# Altium schematic sheet TDC.SchDoc: TDC
size 420 x 297 mm; CheckedBy: -; CompanyName: CERN; DrawnBy: GK; Organization: CERN; Address1: European Organization for Nuclear Research; Address2: CH-1211 Genève 23 - Switzerland; Revision: -; SheetNumber: 7; SheetTotal: 9; EDA_Number: EDA-XXXXX-VX-X; Projet: FMC Delay 1ns 4cha; ModifiedBy: -; CreateDate: XX/XX/XXXX; CheckedDate: -; Title2: Title2; DivGrp: BE-CO; Designer: GK; ModifiedDate: -
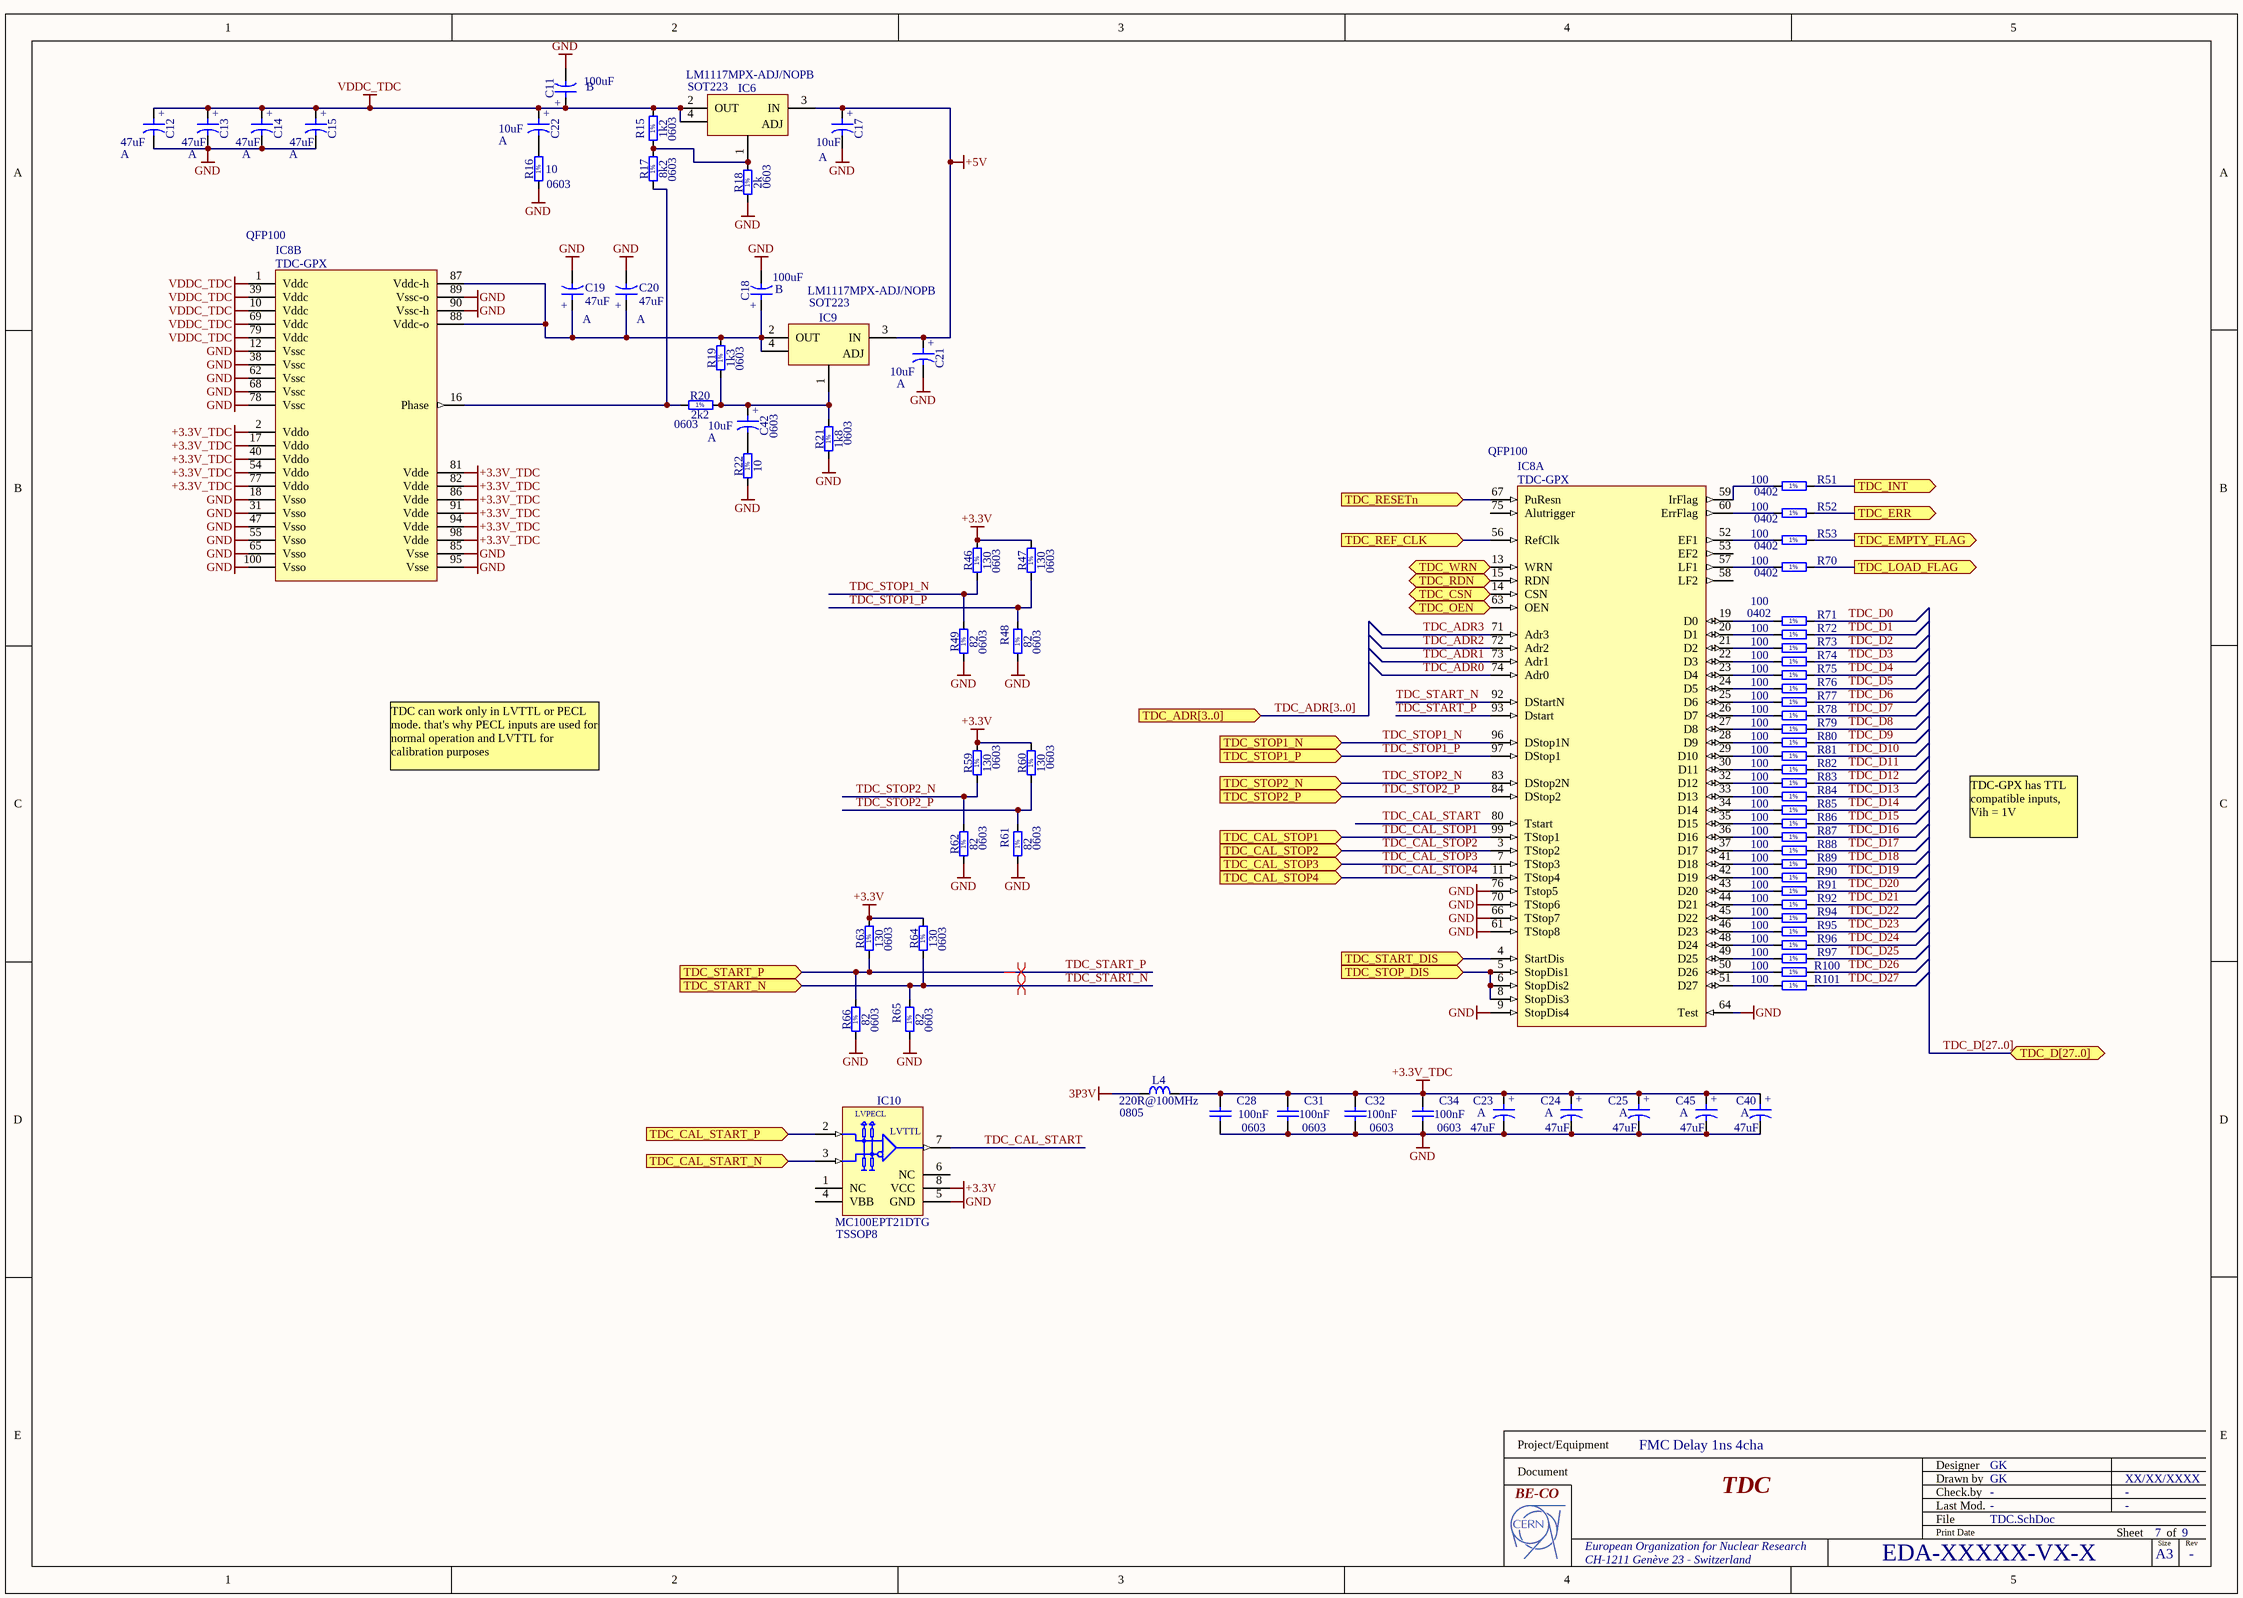
[diagram p0: TDC.SchDoc]

## Parts
C11  100uF  Case: B  [CAPMP3528X210N]
C12  47uF  Case: A  [CAPMP3216X180N]
C13  47uF  Case: A  [CAPMP3216X180N]
C14  47uF  Case: A  [CAPMP3216X180N]
C15  47uF  Case: A  [CAPMP3216X180N]
C17  10uF  Case: A  [CAPMP3216X180N]
C18  100uF  Case: B  [CAPMP3528X210N]
C19  47uF  Case: A  [CAPMP3216X180N]
C20  47uF  Case: A  [CAPMP3216X180N]
C21  10uF  Case: A  [CAPMP3216X180N]
C22  10uF  Case: A  [CAPMP3216X180N]
C23  47uF  Case: A  [CAPMP3216X180N]
C24  47uF  Case: A  [CAPMP3216X180N]
C25  47uF  Case: A  [CAPMP3216X180N]
C28  100nF  Case: 0603  [CAPC1608X87N]
C31  100nF  Case: 0603  [CAPC1608X87N]
C32  100nF  Case: 0603  [CAPC1608X87N]
C34  100nF  Case: 0603  [CAPC1608X87N]
C40  47uF  Case: A  [CAPMP3216X180N]
C42  10uF  Case: A  [CAPMP3216X180N]
C45  47uF  Case: A  [CAPMP3216X180N]
IC6  LM1117MPX-ADJ/NOPB  Case: SOT223  [SOT230P700X180-4N]
IC8  TDC-GPX  Case: QFP100  [QFP50P1600X1600X120-100N]  (parts A,B of 2)
IC9  LM1117MPX-ADJ/NOPB  Case: SOT223  [SOT230P700X180-4N]
IC10  MC100EPT21DTG  Case: TSSOP8  [SOP65P490X110-8N]
L4  220R@100MHz  Case: 0805  [INDC2012X105N]
R15  1k2  Case: 0603  [RESC1608X55N]
R16  10  Case: 0603  [RESC1608X55N]
R17  8k2  Case: 0603  [RESC1608X55N]
R18  2k  Case: 0603  [RESC1608X55N]
R19  1k3  Case: 0603  [RESC1608X55N]
R20  2k2  Case: 0603  [RESC1608X55N]
R21  1k8  Case: 0603  [RESC1608X55N]
R22  10  Case: 0603  [RESC1608X55N]
R46  130  Case: 0603  [RESC1608X55N]
R47  130  Case: 0603  [RESC1608X55N]
R48  82  Case: 0603  [RESC1608X55N]
R49  82  Case: 0603  [RESC1608X55N]
R51  100  Case: 0402  [RESC1005X40N]
R52  100  Case: 0402  [RESC1005X40N]
R53  100  Case: 0402  [RESC1005X40N]
R59  130  Case: 0603  [RESC1608X55N]
R60  130  Case: 0603  [RESC1608X55N]
R61  82  Case: 0603  [RESC1608X55N]
R62  82  Case: 0603  [RESC1608X55N]
R63  130  Case: 0603  [RESC1608X55N]
R64  130  Case: 0603  [RESC1608X55N]
R65  82  Case: 0603  [RESC1608X55N]
R66  82  Case: 0603  [RESC1608X55N]
R70  100  Case: 0402  [RESC1005X40N]
R71  100  Case: 0402  [RESC1005X40N]
R72  100  [RESC1005X40N]
R73  100  [RESC1005X40N]
R74  100  [RESC1005X40N]
R75  100  [RESC1005X40N]
R76  100  [RESC1005X40N]
R77  100  [RESC1005X40N]
R78  100  [RESC1005X40N]
R79  100  [RESC1005X40N]
R80  100  [RESC1005X40N]
R81  100  [RESC1005X40N]
R82  100  [RESC1005X40N]
R83  100  [RESC1005X40N]
R84  100  [RESC1005X40N]
R85  100  [RESC1005X40N]
R86  100  [RESC1005X40N]
R87  100  [RESC1005X40N]
R88  100  [RESC1005X40N]
R89  100  [RESC1005X40N]
R90  100  [RESC1005X40N]
R91  100  [RESC1005X40N]
R92  100  [RESC1005X40N]
R94  100  [RESC1005X40N]
R95  100  [RESC1005X40N]
R96  100  [RESC1005X40N]
R97  100  [RESC1005X40N]
R100  100  [RESC1005X40N]
R101  100  [RESC1005X40N]

## Ports
TDC_ADR[3..0] (in), TDC_CAL_START_N (in), TDC_CAL_START_P (in), TDC_CAL_STOP1 (in), TDC_CAL_STOP2 (in), TDC_CAL_STOP3 (in), TDC_CAL_STOP4 (in), TDC_CSN (in), TDC_D[27..0] (bidir), TDC_EMPTY_FLAG (out), TDC_ERR (out), TDC_INT (out), TDC_LOAD_FLAG (out), TDC_OEN (in), TDC_RDN (in), TDC_REF_CLK (in), TDC_RESETn (in), TDC_START_DIS (in), TDC_START_N (in), TDC_START_P (in), TDC_STOP1_N (in), TDC_STOP1_P (in), TDC_STOP2_N (in), TDC_STOP2_P (in), TDC_STOP_DIS (in), TDC_WRN (in)

## Nets
3P3V: L4.1
+3.3V: IC10.8(VCC) R46.2 R47.2 R59.2 R60.2 R63.2 R64.2
+3.3V_TDC: C23.1 C24.1 C25.1 C28.1 C31.1 C32.1 C34.1 C40.1 C45.1 IC8.2(Vddo) IC8.17(Vddo) IC8.40(Vddo) IC8.54(Vddo) IC8.77(Vddo) IC8.81(Vdde) IC8.82(Vdde) IC8.86(Vdde) IC8.91(Vdde) IC8.94(Vdde) IC8.98(Vdde) L4.2
+5V: C17.1 C21.1 IC6.3(IN) IC9.3(IN)
GND: C11.2 C12.2 C13.2 C14.2 C15.2 C17.2 C18.2 C19.2 C20.2 C21.2 C23.2 C24.2 C25.2 C28.2 C31.2 C32.2 C34.2 C40.2 C45.2 IC8.9(StopDis4) IC8.12(Vssc) IC8.18(Vsso) IC8.31(Vsso) IC8.38(Vssc) IC8.47(Vsso) IC8.55(Vsso) IC8.61(TStop8) IC8.62(Vssc) IC8.64(Test) IC8.65(Vsso) IC8.66(TStop7) IC8.68(Vssc) IC8.70(TStop6) IC8.76(Tstop5) IC8.78(Vssc) IC8.85(Vsse) IC8.89(Vssc-o) IC8.90(Vssc-h) IC8.95(Vsse) IC8.100(Vsso) IC10.5(GND) R16.1 R18.1 R21.1 R22.1 R48.1 R49.1 R61.1 R62.1 R65.1 R66.1
VDDC_TDC: C11.1 C12.1 C13.1 C14.1 C15.1 C22.1 IC6.2(OUT) IC6.4(OUT) IC8.1(Vddc) IC8.10(Vddc) IC8.39(Vddc) IC8.69(Vddc) IC8.79(Vddc) R15.2
TDC_ADR0: IC8.74(Adr0)
TDC_ADR1: IC8.73(Adr1)
TDC_ADR2: IC8.72(Adr2)
TDC_ADR3: IC8.71(Adr3)
TDC_CAL_START: IC8.80(Tstart) IC10.7(Q0)
TDC_CAL_START_N: IC10.3(~{D0}) ; port TDC_CAL_START_N
TDC_CAL_START_P: IC10.2(D0) ; port TDC_CAL_START_P
TDC_CAL_STOP1: IC8.99(TStop1) ; port TDC_CAL_STOP1
TDC_CAL_STOP2: IC8.3(TStop2) ; port TDC_CAL_STOP2
TDC_CAL_STOP3: IC8.7(TStop3) ; port TDC_CAL_STOP3
TDC_CAL_STOP4: IC8.11(TStop4) ; port TDC_CAL_STOP4
TDC_CSN: IC8.14(CSN) ; port TDC_CSN
TDC_D0: R71.2
TDC_D1: R72.2
TDC_D2: R73.2
TDC_D3: R74.2
TDC_D4: R75.2
TDC_D5: R76.2
TDC_D6: R77.2
TDC_D7: R78.2
TDC_D8: R79.2
TDC_D9: R80.2
TDC_D10: R81.2
TDC_D11: R82.2
TDC_D12: R83.2
TDC_D13: R84.2
TDC_D14: R85.2
TDC_D15: R86.2
TDC_D16: R87.2
TDC_D17: R88.2
TDC_D18: R89.2
TDC_D19: R90.2
TDC_D20: R91.2
TDC_D21: R92.2
TDC_D22: R94.2
TDC_D23: R95.2
TDC_D24: R96.2
TDC_D25: R97.2
TDC_D26: R100.2
TDC_D27: R101.2
TDC_EMPTY_FLAG: R53.2 ; port TDC_EMPTY_FLAG
TDC_ERR: R52.2 ; port TDC_ERR
TDC_INT: R51.2 ; port TDC_INT
TDC_LOAD_FLAG: R70.2 ; port TDC_LOAD_FLAG
TDC_OEN: IC8.63(OEN) ; port TDC_OEN
TDC_RDN: IC8.15(RDN) ; port TDC_RDN
TDC_REF_CLK: IC8.56(RefClk) ; port TDC_REF_CLK
TDC_RESETn: IC8.67(PuResn) ; port TDC_RESETn
TDC_START_DIS: IC8.4(StartDis) ; port TDC_START_DIS
TDC_START_N: IC8.92(DStartN) R64.1 R65.2 ; port TDC_START_N
TDC_START_P: IC8.93(Dstart) R63.1 R66.2 ; port TDC_START_P
TDC_STOP1_N: IC8.96(DStop1N) R46.1 R49.2 ; port TDC_STOP1_N
TDC_STOP1_P: IC8.97(DStop1) R47.1 R48.2 ; port TDC_STOP1_P
TDC_STOP2_N: IC8.83(DStop2N) R59.1 R62.2 ; port TDC_STOP2_N
TDC_STOP2_P: IC8.84(DStop2) R60.1 R61.2 ; port TDC_STOP2_P
TDC_STOP_DIS: IC8.5(StopDis1) IC8.6(StopDis2) IC8.8(StopDis3) ; port TDC_STOP_DIS
TDC_WRN: IC8.13(WRN) ; port TDC_WRN
NetC18_1: C18.1 C19.1 C20.1 IC8.87(Vddc-h) IC8.88(Vddc-o) IC9.2(OUT) IC9.4(OUT) R19.2
NetC22_2: C22.2 R16.2
NetC42_1: C42.1 IC9.1(ADJ) R19.1 R20.2 R21.2
NetC42_2: C42.2 R22.2
NetIC6_1: IC6.1(ADJ) R15.1 R17.2 R18.2
NetIC8_16: IC8.16(Phase) R17.1 R20.1
NetIC8_19: IC8.19(D0) R71.1
NetIC8_20: IC8.20(D1) R72.1
NetIC8_21: IC8.21(D2) R73.1
NetIC8_22: IC8.22(D3) R74.1
NetIC8_23: IC8.23(D4) R75.1
NetIC8_24: IC8.24(D5) R76.1
NetIC8_25: IC8.25(D6) R77.1
NetIC8_26: IC8.26(D7) R78.1
NetIC8_27: IC8.27(D8) R79.1
NetIC8_28: IC8.28(D9) R80.1
NetIC8_29: IC8.29(D10) R81.1
NetIC8_30: IC8.30(D11) R82.1
NetIC8_32: IC8.32(D12) R83.1
NetIC8_33: IC8.33(D13) R84.1
NetIC8_34: IC8.34(D14) R85.1
NetIC8_35: IC8.35(D15) R86.1
NetIC8_36: IC8.36(D16) R87.1
NetIC8_37: IC8.37(D17) R88.1
NetIC8_41: IC8.41(D18) R89.1
NetIC8_42: IC8.42(D19) R90.1
NetIC8_43: IC8.43(D20) R91.1
NetIC8_44: IC8.44(D21) R92.1
NetIC8_45: IC8.45(D22) R94.1
NetIC8_46: IC8.46(D23) R95.1
NetIC8_48: IC8.48(D24) R96.1
NetIC8_49: IC8.49(D25) R97.1
NetIC8_50: IC8.50(D26) R100.1
NetIC8_51: IC8.51(D27) R101.1
NetIC8_52: IC8.52(EF1) R53.1
NetIC8_57: IC8.57(LF1) R70.1
NetIC8_59: IC8.59(IrFlag) R51.1
NetIC8_60: IC8.60(ErrFlag) R52.1

Not connected (* = marked no-connect by the designer): IC8 53(EF2) 58(LF2) 75(Alutrigger); IC10 1(NC) 4(VBB) 6(NC)

## Buses and harness runs
bus TDC_ADR[3..0] = port TDC_ADR[3..0]
bus TDC_D[27..0] = port TDC_D[27..0]

## Layout directives
differential pair: TDC_START_N, TDC_START_P

## Notes on the sheet
- TDC can work only in LVTTL or PECL mode. that's why PECL inputs are used for normal operation and LVTTL for calibration purposes
- TDC-GPX has TTL compatible inputs, Vih = 1V
- Project/Equipment
- Document
- TDC
- Designer
- Drawn by
- Check.by
- File
- Last Mod.
- Print Date
- Sheet
- Size
- A3
- of
- Rev
- (in symbol CTE3216-18_10UF_10V_10%_LESR1800) +
- (in symbol CTE3216-18_47UF_2.5V_10%) +
- (in symbol CTE3528-21_100UF_6.3V_10%) +
- (in symbol MC100EPT21DTG) LVPECL; LVTTL
- (in symbol R0402_100R_1%_0.0625W_100PPM) 1%
- (in symbol R0603_1K2_1%_0.1W_100PPM) 1%
- (in symbol R0603_1K3_1%_0.1W_100PPM) 1%
- (in symbol R0603_1K8_1%_0.1W_100PPM) 1%
- (in symbol R0603_2K2_1%_0.1W_100PPM) 1%
- (in symbol R0603_2K_1%_0.1W_100PPM) 1%
- (in symbol R0603_8K2_1%_0.1W_100PPM) 1%
- (in symbol R0603_10R_1%_0.1W_200PPM) 1%
- (in symbol R0603_82R_1%_0.1W_100PPM) 1%
- (in symbol R0603_130R_1%_0.1W_100PPM) 1%

## Library data of the parts
C11 C18 = CTE3528-21_100UF_6.3V_10%: Polarised capacitor; Part Description: Solid Tantalum Chip Capacitor; Manufacturer: GENERIC; Manufacturer1 Part Number: TAJB107K006R; Voltage: 6.3V; Tolerance: ±10%; Table: Capacitors SMD; Part Number: CTE3528-21_100UF_6.3V_10%; Component Kind: Standard; Component Type: Standard; Pin Count: 2; Value: 100uF; Status: Preferred; Manufacturer Part Number: CTE3528-21_100UF_6.3V_10%; Mounted: Yes; Socket: No; SMD: Yes; Manufacturer1 Example: AVX; Manufacturer1 ComponentHeight: 2.1mm; HelpURL: \\cern.ch\dfs\Applications\Altium\Datasheets\CTE_AVX_TAJ.pdf; Author: CERN DEM JLC; CreateDate: 2007-12-03; LatestRevisionDate: 2007-12-03
C12-C15 C19 C20 C23-C25 C40 C45 = CTE3216-18_47UF_2.5V_10%: Polarised capacitor; Part Description: Solid Tantalum Chip Capacitor; Manufacturer: GENERIC; Manufacturer1 Part Number: TAJA476K002R; Voltage: 2.5V; Tolerance: ±10%; Table: Capacitors SMD; Part Number: CTE3216-18_47UF_2.5V_10%; Component Kind: Standard; Component Type: Standard; Pin Count: 2; Value: 47uF; Status: Preferred; Manufacturer Part Number: CTE3216-18_47UF_2.5V_10%; Mounted: Yes; Socket: No; SMD: Yes; Manufacturer1 Example: AVX; Manufacturer1 ComponentHeight: 1.8mm; HelpURL: \\cern.ch\dfs\Applications\Altium\Datasheets\CTE_AVX_TAJ.pdf; Author: CERN DEM JLC; CreateDate: 2007-12-03; LatestRevisionDate: 2007-12-03
C17 C21 C22 C42 = CTE3216-18_10UF_10V_10%_LESR1800: Polarised capacitor; Part Description: Low ESR 1R8 Solid Tantalum Chip Capacitor; Manufacturer: GENERIC; Manufacturer1 Part Number: TPSA106K010R1800; Voltage: 10V; Tolerance: ±10%; Table: Capacitors SMD; Part Number: CTE3216-18_10UF_10V_10%_LESR1800; Component Kind: Standard; Component Type: Standard; Pin Count: 2; Value: 10uF; Status: Preferred; Manufacturer Part Number: CTE3216-18_10UF_10V_10%_LESR1800; Mounted: Yes; Socket: No; SMD: Yes; Manufacturer1 Example: AVX; Manufacturer1 ComponentHeight: 1.8mm; HelpURL: \\cern.ch\dfs\Applications\Altium\Datasheets\CTE-LESR_AVX_TPS.pdf; Author: CERN DEM JLC; CreateDate: 2008-05-05; LatestRevisionDate: 2009-01-20
C28 C31 C32 C34 = CC0603_100NF_50V_10%_X7R: Non-polarised capacitor; Manufacturer1 Part Number: 223858615649; Manufacturer: GENERIC; Part Description: SMD Multilayer Chip Ceramic Capacitor; Table: Capacitors SMD; TC: X7R; Tolerance: ±10%; Voltage: 50V; Author: CERN DEM JLC; Component Type: Standard; CreateDate: 03.12.2007; HelpURL: \\cern.ch\dfs\Applications\Altium\Datasheets\CC0603_X7R_PHYCOMP.pdf; LatestRevisionDate: 03.12.2007; Manufacturer1 ComponentHeight: 0.87mm; Manufacturer1 Example: PHYCOMP; Manufacturer Part Number: CC0603_100NF_50V_10%_X7R; Mounted: Yes; Pin Count: 2; SMD: Yes; Socket: No; Status: Preferred; Value: 100nF; Part Number: CC0603_100NF_50V_10%_X7R; Component Kind: Standard
IC6 IC9 = LM1117MPX-ADJ/NOPB: 3-Terminal Regulator 1=Adj 2=OUT 3=INt 4=OUT; Part Description: 1.25V to 13.8V, 800mA, Adjustable Low-Dropout Linear Regulator; Manufacturer: NATIONAL SEMICONDUCTOR; Table: Regulators; Part Number: LM1117MPX-ADJ/NOPB; Component Kind: Standard; Component Type: Standard; Device: LM1117MPX-ADJ/NOPB; PackageDescription: SOT223, 2.30mm pitch; 3 pin, 3.70mm W X 6.70mm L, IPC Medium Density; Manufacturer Part Number: LM1117MPX-ADJ/NOPB; Pin Count: 4; Mounted: Yes; Socket: No; SMD: Yes; ComponentHeight: 1.8mm; HelpURL: \\cern.ch\dfs\Applications\Altium\Datasheets\LM1117MPX-ADJ-NOPB.pdf; Author: CERN DEM JLC; CreateDate: 2010-07-05; LatestRevisionDate: 2010-07-05
IC8 = TDC-GPX: Multifunctional High-End Time-to-Digital Converter (4 different operation modes, 81 ps up to 10 ps resolution); Manufacturer: ACAM MESS-ELECTRONIC; Table: Analog & Interface; Part Number: TDC-GPX; Component Kind: Standard; Component Type: Standard; Device: TDC-GPX; PackageDescription: QFP,0.50mm pitch,square;100 pin,14.00mm L X 14.00mm W X 1.20mm H body (w/thermal tab), IPC Medium Density; Part Description: Multifunctional High-End Time-to-Digital Converter (4 different operation modes, 81 ps up to 10 ps resolution); Manufacturer Part Number: TDC-GPX; Pin Count: 100; Mounted: Yes; Socket: No; SMD: Yes; ComponentHeight: 1.2mm; Author: CERN DEM JLC; HelpURL: \\cern.ch\dfs\Applications\Altium\Datasheets\TDC-GPX.pdf; CreateDate: 2010-07-05; LatestRevisionDate: 2010-07-05
IC10 = MC100EPT21DTG: 3.3V Differential LVPECL/LVDS/CML  to LVTTL/LVCMOS Translator; Manufacturer: ON SEMICONDUCTOR; Table: Standard Logic; Part Number: MC100EPT21DTG; Component Kind: Standard; Component Type: Standard; Device: MC100EPT21DTG; PackageDescription: SOP, 0.65mm pitch; 8 pin, 3.00mm W X 3.00mm L X 1.10mm H body, IPC Medium Density; Part Description: 3.3V Differential LVPECL/LVDS/CML  to LVTTL/LVCMOS Translator; Manufacturer Part Number: MC100EPT21DTG; Pin Count: 8; Mounted: Yes; Socket: No; SMD: Yes; ComponentHeight: 1.1mm; Author: CERN DEM JLC; HelpURL: \\cern.ch\dfs\Applications\Altium\Datasheets\MC100EPT21DTG.pdf; CreateDate: 2010-07-06; LatestRevisionDate: 2010-07-06
L4 = IND0805_MURATA_BLM21PG221SN1D: Inductor; Part Description: SMD EMIFIL Suppression Chip Bead Ferrite; Manufacturer: MURATA; Power: 2A; Resistance: 0.05R; Tolerance: ±25%; Table: Inductors SMD; Part Number: IND0805_MURATA_BLM21PG221SN1D; Component Kind: Standard; Component Type: Standard; Pin Count: 2; Value: 220R@100MHz; Status: None; Manufacturer Part Number: BLM21PG221SN1D; Mounted: Yes; Socket: No; SMD: Yes; ComponentHeight: 1.05mm; HelpURL: \\cern.ch\dfs\Applications\Altium\Datasheets\IND0402_MURATA_BLM21P.pdf; Author: CERN DEM JLC; CreateDate: 2010-01-25; LatestRevisionDate: 2010-01-25
R15 = R0603_1K2_1%_0.1W_100PPM: Resistor - 1%; Part Description: General Purpose Thick Film Chip Resistor; Manufacturer: GENERIC; Manufacturer1 Part Number: NRC06F1201TRF; Power: 0.1W; TC: ±100ppm/°C; Table: Resistors SMD; Part Number: R0603_1K2_1%_0.1W_100PPM; Component Kind: Standard; Component Type: Standard; Pin Count: 2; Value: 1k2; Status: Preferred; Tolerance: ±1%; Manufacturer Part Number: R0603_1K2_1%_0.1W_100PPM; Mounted: Yes; Socket: No; SMD: Yes; Manufacturer1 Example: NIC COMPONENT; Manufacturer1 ComponentHeight: 0.55mm; HelpURL: \\cern.ch\dfs\Applications\Altium\Datasheets\R0603_NIC_NRC.pdf; Author: CERN DEM JLC; CreateDate: 2007-12-03; LatestRevisionDate: 2008-03-13
R16 R22 = R0603_10R_1%_0.1W_200PPM: Resistor - 1%; Part Description: General Purpose Thick Film Chip Resistor; Manufacturer: GENERIC; Manufacturer1 Part Number: NRC06F10R0TRF; Power: 0.1W; TC: ±200ppm/°C; Table: Resistors SMD; Part Number: R0603_10R_1%_0.1W_200PPM; Component Kind: Standard; Component Type: Standard; Pin Count: 2; Value: 10; Status: Preferred; Tolerance: ±1%; Manufacturer Part Number: R0603_10R_1%_0.1W_200PPM; Mounted: Yes; Socket: No; SMD: Yes; Manufacturer1 Example: NIC COMPONENT; Manufacturer1 ComponentHeight: 0.55mm; HelpURL: \\cern.ch\dfs\Applications\Altium\Datasheets\R0603_NIC_NRC.pdf; Author: CERN DEM JLC; CreateDate: 2007-12-03; LatestRevisionDate: 2009-06-24
R17 = R0603_8K2_1%_0.1W_100PPM: Resistor - 1%; Part Description: General Purpose Thick Film Chip Resistor; Manufacturer: GENERIC; Manufacturer1 Part Number: NRC06F8201TRF; Power: 0.1W; TC: ±100ppm/°C; Table: Resistors SMD; Part Number: R0603_8K2_1%_0.1W_100PPM; Component Kind: Standard; Component Type: Standard; Pin Count: 2; Value: 8k2; Status: Preferred; Tolerance: ±1%; Manufacturer Part Number: R0603_8K2_1%_0.1W_100PPM; Mounted: Yes; Socket: No; SMD: Yes; Manufacturer1 Example: NIC COMPONENT; Manufacturer1 ComponentHeight: 0.55mm; HelpURL: \\cern.ch\dfs\Applications\Altium\Datasheets\R0603_NIC_NRC.pdf; Author: CERN DEM JLC; CreateDate: 2007-12-03; LatestRevisionDate: 2008-03-13
R18 = R0603_2K_1%_0.1W_100PPM: Resistor - 1%; Part Description: General Purpose Thick Film Chip Resistor; Manufacturer: GENERIC; Manufacturer1 Part Number: NRC06F2001TRF; Power: 0.1W; TC: ±100ppm/°C; Table: Resistors SMD; Part Number: R0603_2K_1%_0.1W_100PPM; Component Kind: Standard; Component Type: Standard; Pin Count: 2; Value: 2k; Status: Preferred; Tolerance: ±1%; Manufacturer Part Number: R0603_2K_1%_0.1W_100PPM; Mounted: Yes; Socket: No; SMD: Yes; Manufacturer1 Example: NIC COMPONENT; Manufacturer1 ComponentHeight: 0.55mm; HelpURL: \\cern.ch\dfs\Applications\Altium\Datasheets\R0603_NIC_NRC.pdf; Author: CERN DEM JLC; CreateDate: 2007-12-03; LatestRevisionDate: 2008-03-13
R19 = R0603_1K3_1%_0.1W_100PPM: Resistor - 1%; Part Description: General Purpose Thick Film Chip Resistor; Manufacturer: GENERIC; Manufacturer1 Part Number: NRC06F1301TRF; Power: 0.1W; TC: ±100ppm/°C; Table: Resistors SMD; Part Number: R0603_1K3_1%_0.1W_100PPM; Component Kind: Standard; Component Type: Standard; Pin Count: 2; Value: 1k3; Status: Preferred; Tolerance: ±1%; Manufacturer Part Number: R0603_1K3_1%_0.1W_100PPM; Mounted: Yes; Socket: No; SMD: Yes; Manufacturer1 Example: NIC COMPONENT; Manufacturer1 ComponentHeight: 0.55mm; HelpURL: \\cern.ch\dfs\Applications\Altium\Datasheets\R0603_NIC_NRC.pdf; Author: CERN DEM JLC; CreateDate: 2007-12-03; LatestRevisionDate: 2008-03-13
R20 = R0603_2K2_1%_0.1W_100PPM: Resistor - 1%; Part Description: General Purpose Thick Film Chip Resistor; Manufacturer: GENERIC; Manufacturer1 Part Number: NRC06F2201TRF; Power: 0.1W; TC: ±100ppm/°C; Table: Resistors SMD; Part Number: R0603_2K2_1%_0.1W_100PPM; Component Kind: Standard; Component Type: Standard; Pin Count: 2; Value: 2k2; Status: Preferred; Tolerance: ±1%; Manufacturer Part Number: R0603_2K2_1%_0.1W_100PPM; Mounted: Yes; Socket: No; SMD: Yes; Manufacturer1 Example: NIC COMPONENT; Manufacturer1 ComponentHeight: 0.55mm; HelpURL: \\cern.ch\dfs\Applications\Altium\Datasheets\R0603_NIC_NRC.pdf; Author: CERN DEM JLC; CreateDate: 2007-12-03; LatestRevisionDate: 2008-03-13
R21 = R0603_1K8_1%_0.1W_100PPM: Resistor - 1%; Part Description: General Purpose Thick Film Chip Resistor; Manufacturer: GENERIC; Manufacturer1 Part Number: NRC06F1801TRF; Power: 0.1W; TC: ±100ppm/°C; Table: Resistors SMD; Part Number: R0603_1K8_1%_0.1W_100PPM; Component Kind: Standard; Component Type: Standard; Pin Count: 2; Value: 1k8; Status: Preferred; Tolerance: ±1%; Manufacturer Part Number: R0603_1K8_1%_0.1W_100PPM; Mounted: Yes; Socket: No; SMD: Yes; Manufacturer1 Example: NIC COMPONENT; Manufacturer1 ComponentHeight: 0.55mm; HelpURL: \\cern.ch\dfs\Applications\Altium\Datasheets\R0603_NIC_NRC.pdf; Author: CERN DEM JLC; CreateDate: 2007-12-03; LatestRevisionDate: 2008-03-13
R46 R47 R59 R60 R63 R64 = R0603_130R_1%_0.1W_100PPM: Resistor - 1%; Part Description: General Purpose Thick Film Chip Resistor; Manufacturer: GENERIC; Manufacturer1 Part Number: NRC06F1300TRF; Power: 0.1W; TC: ±100ppm/°C; Table: Resistors SMD; Part Number: R0603_130R_1%_0.1W_100PPM; Component Kind: Standard; Component Type: Standard; Pin Count: 2; Value: 130; Status: Preferred; Tolerance: ±1%; Manufacturer Part Number: R0603_130R_1%_0.1W_100PPM; Mounted: Yes; Socket: No; SMD: Yes; Manufacturer1 Example: NIC COMPONENT; Manufacturer1 ComponentHeight: 0.55mm; HelpURL: \\cern.ch\dfs\Applications\Altium\Datasheets\R0603_NIC_NRC.pdf; Author: CERN DEM JLC; CreateDate: 2007-12-03; LatestRevisionDate: 2008-03-13
R48 R49 R61 R62 R65 R66 = R0603_82R_1%_0.1W_100PPM: Resistor - 1%; Part Description: General Purpose Thick Film Chip Resistor; Manufacturer: GENERIC; Manufacturer1 Part Number: NRC06F82R0TRF; Power: 0.1W; TC: ±100ppm/°C; Table: Resistors SMD; Part Number: R0603_82R_1%_0.1W_100PPM; Component Kind: Standard; Component Type: Standard; Pin Count: 2; Value: 82; Status: Preferred; Tolerance: ±1%; Manufacturer Part Number: R0603_82R_1%_0.1W_100PPM; Mounted: Yes; Socket: No; SMD: Yes; Manufacturer1 Example: NIC COMPONENT; Manufacturer1 ComponentHeight: 0.55mm; HelpURL: \\cern.ch\dfs\Applications\Altium\Datasheets\R0603_NIC_NRC.pdf; Author: CERN DEM JLC; CreateDate: 2007-12-03; LatestRevisionDate: 2008-03-13
R51-R53 R70-R92 R94-R97 R100 R101 = R0402_100R_1%_0.0625W_100PPM: Resistor - 1%; Part Description: General Purpose Thick Film Chip Resistor; Manufacturer: GENERIC; Manufacturer1 Part Number: 232270671001; TC: ±100ppm/°C; Table: Resistors SMD; Part Number: R0402_100R_1%_0.0625W_100PPM; Component Kind: Standard; Component Type: Standard; Pin Count: 2; Value: 100; Status: Not recommended; Power: 0.0625W; Tolerance: ±1%; Manufacturer Part Number: R0402_100R_1%_0.0625W_100PPM; Mounted: Yes; Socket: No; SMD: Yes; Manufacturer1 Example: PHYCOMP; Manufacturer1 ComponentHeight: 0.4mm; HelpURL: \\cern.ch\dfs\Applications\Altium\Datasheets\R0402_Phycomp_RC0402.pdf; Author: CERN DEM JLC; CreateDate: 2007-12-03; LatestRevisionDate: 2008-03-13
  R72-R92 R94-R97 R100 R101: Case: 0402